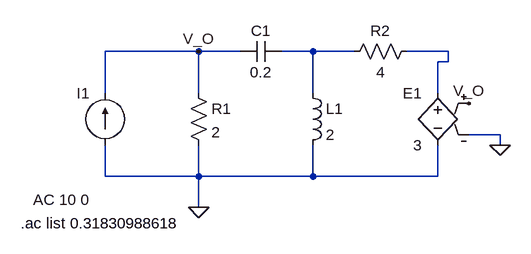
[diagram p0: schematic 10.1.practice-problem.asc]
10.1.practice-problem.asc, the LTspice schematic file:
Version 4
SHEET 1 880 680
WIRE 288 176 144 176
WIRE 352 176 288 176
WIRE 464 176 416 176
WIRE 528 176 464 176
WIRE 672 176 608 176
WIRE 672 192 672 176
WIRE 672 192 656 192
WIRE 144 240 144 176
WIRE 288 240 288 176
WIRE 464 240 464 176
WIRE 656 240 656 192
WIRE 752 304 704 304
WIRE 752 320 752 304
WIRE 144 368 144 320
WIRE 288 368 288 320
WIRE 288 368 144 368
WIRE 464 368 464 320
WIRE 464 368 288 368
WIRE 656 368 656 320
WIRE 656 368 464 368
WIRE 288 416 288 368
FLAG 288 176 V_O
FLAG 288 416 0
FLAG 752 320 0
FLAG 704 256 V_O
SYMBOL current 144 320 R180
WINDOW 0 24 80 Left 2
WINDOW 3 24 -56 Left 2
WINDOW 123 24 -84 Left 2
WINDOW 39 0 0 Left 0
SYMATTR InstName I1
SYMATTR Value ""
SYMATTR Value2 AC 10 0
SYMBOL res 272 224 R0
SYMATTR InstName R1
SYMATTR Value 2
SYMBOL ind 448 224 R0
SYMATTR InstName L1
SYMATTR Value 2
SYMBOL e 656 224 M0
SYMATTR InstName E1
SYMATTR Value 3
SYMBOL cap 416 160 R90
WINDOW 0 0 32 VBottom 2
WINDOW 3 32 32 VTop 2
SYMATTR InstName C1
SYMATTR Value 0.2
SYMBOL res 624 160 R90
WINDOW 0 0 56 VBottom 2
WINDOW 3 32 56 VTop 2
SYMATTR InstName R2
SYMATTR Value 4
TEXT 14 440 Left 2 !.ac list 0.31830988618

The netlist it stands for:
* 10.1.practice-problem.asc
I1 0 V_O AC 10 0
R1 V_O 0 2
L1 N001 0 2
E1 N002 0 V_O 0 3
C1 N001 V_O 0.2
R2 N002 N001 4
.ac list 0.31830988618
.backanno
.end